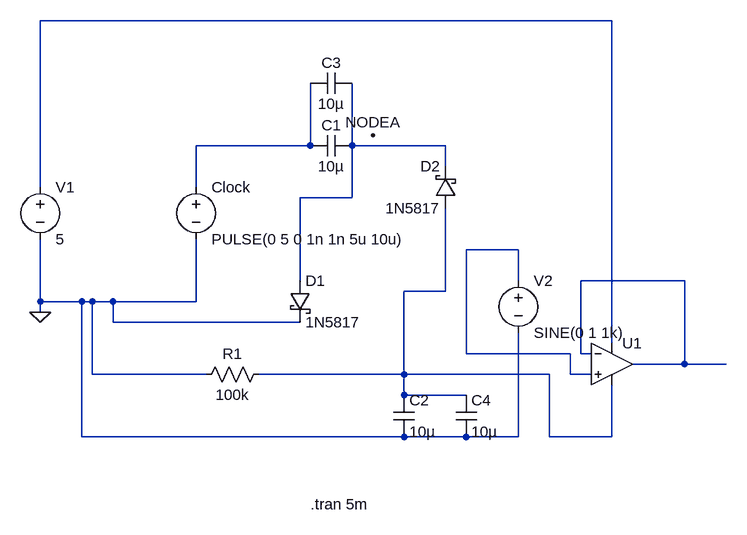
[diagram p0: schematic Working Model.asc]
Working Model.asc, the LTspice schematic file:
Version 4.1
SHEET 1 1620 680
WIRE 1232 -336 352 -336
WIRE 768 -144 768 -240
WIRE 768 -144 592 -144
WIRE 832 -144 832 -240
WIRE 976 -144 832 -144
WIRE 976 -112 976 -144
WIRE 352 -80 352 -336
WIRE 592 -80 592 -144
WIRE 832 -64 832 -144
WIRE 832 -64 752 -64
WIRE 1088 16 1008 16
WIRE 752 64 752 -64
WIRE 1088 64 1088 16
WIRE 1344 64 1184 64
WIRE 976 80 976 -48
WIRE 976 80 912 80
WIRE 352 96 352 0
WIRE 416 96 352 96
WIRE 432 96 416 96
WIRE 464 96 432 96
WIRE 592 96 592 0
WIRE 592 96 464 96
WIRE 352 112 352 96
WIRE 464 128 464 96
WIRE 752 128 464 128
WIRE 1232 160 1232 -336
WIRE 1008 176 1008 16
WIRE 1168 176 1008 176
WIRE 1184 176 1184 64
WIRE 1200 176 1184 176
WIRE 1344 192 1344 64
WIRE 1344 192 1264 192
WIRE 1408 192 1344 192
WIRE 432 208 432 96
WIRE 608 208 432 208
WIRE 912 208 912 80
WIRE 912 208 688 208
WIRE 1136 208 912 208
WIRE 1168 208 1168 176
WIRE 1200 208 1168 208
WIRE 912 240 912 208
WIRE 1008 240 912 240
WIRE 416 304 416 96
WIRE 912 304 416 304
WIRE 1008 304 912 304
WIRE 1088 304 1088 144
WIRE 1088 304 1008 304
WIRE 1136 304 1136 208
WIRE 1232 304 1232 224
WIRE 1232 304 1136 304
FLAG 352 112 0
FLAG 864 -160 NODEA
SYMBOL voltage 352 -96 R0
WINDOW 123 0 0 Left 0
WINDOW 39 0 0 Left 0
SYMATTR InstName V1
SYMATTR Value 5
SYMBOL voltage 592 -96 R0
WINDOW 123 0 0 Left 0
WINDOW 39 0 0 Left 0
SYMATTR InstName Clock
SYMATTR Value PULSE(0 5 0 1n 1n 5u 10u)
SYMBOL schottky 736 64 R0
SYMATTR InstName D1
SYMATTR Value 1N5817
SYMATTR Description Diode
SYMATTR Type diode
SYMBOL cap 768 -128 R270
WINDOW 0 32 32 VTop 2
WINDOW 3 0 32 VBottom 2
SYMATTR InstName C1
SYMATTR Value 10µ
SYMATTR SpiceLine Rser=0.02
SYMBOL cap 896 240 R0
SYMATTR InstName C2
SYMATTR Value 10µ
SYMATTR SpiceLine Rser=0.02
SYMBOL res 704 192 R90
WINDOW 0 0 56 VBottom 2
WINDOW 3 32 56 VTop 2
SYMATTR InstName R1
SYMATTR Value 100k
SYMBOL cap 832 -256 R90
WINDOW 0 0 32 VBottom 2
WINDOW 3 32 32 VTop 2
SYMATTR InstName C3
SYMATTR Value 10µ
SYMATTR SpiceLine Rser=0.02
SYMBOL cap 992 240 R0
SYMATTR InstName C4
SYMATTR Value 10µ
SYMATTR SpiceLine Rser=0.02
SYMBOL schottky 992 -48 R180
WINDOW 0 24 64 Left 2
WINDOW 3 24 0 Left 2
SYMATTR InstName D2
SYMATTR Value 1N5817
SYMATTR Description Diode
SYMATTR Type diode
SYMBOL OpAmps\\UniversalOpAmp2 1232 192 R0
SYMATTR InstName U1
SYMBOL voltage 1088 48 R0
WINDOW 123 0 0 Left 0
WINDOW 39 0 0 Left 0
SYMATTR InstName V2
SYMATTR Value SINE(0 1 1k)
TEXT 768 408 Left 2 !.tran 5m

The netlist it stands for:
* Working Model.asc
V1 N001 0 5
V§Clock N002 0 PULSE(0 5 0 1n 1n 5u 10u)
D1 N003 0 1N5817
C1 N002 N003 10µ Rser=0.02
C2 N006 0 10µ Rser=0.02
R1 N006 0 100k
C3 N003 N002 10µ Rser=0.02
C4 N006 0 10µ Rser=0.02
D2 N006 N003 1N5817
X§U1 N004 N005 N001 N006 N005 level2 Avol=1Meg GBW=10Meg Slew=10Meg Ilimit=25m Rail=0 Vos=0 En=0 Enk=0 In=0 Ink=0 Rin=500Meg  ; pins In+ In- V+ V- OUT
V2 N004 0 SINE(0 1 1k)
.model D D
.lib standard.dio
.tran 5m
.lib UniversalOpAmp2.lib
.backanno
.end